# EAGLE schematic OSSI-1 Analog Temp Module (EAGLE 6.5.0)
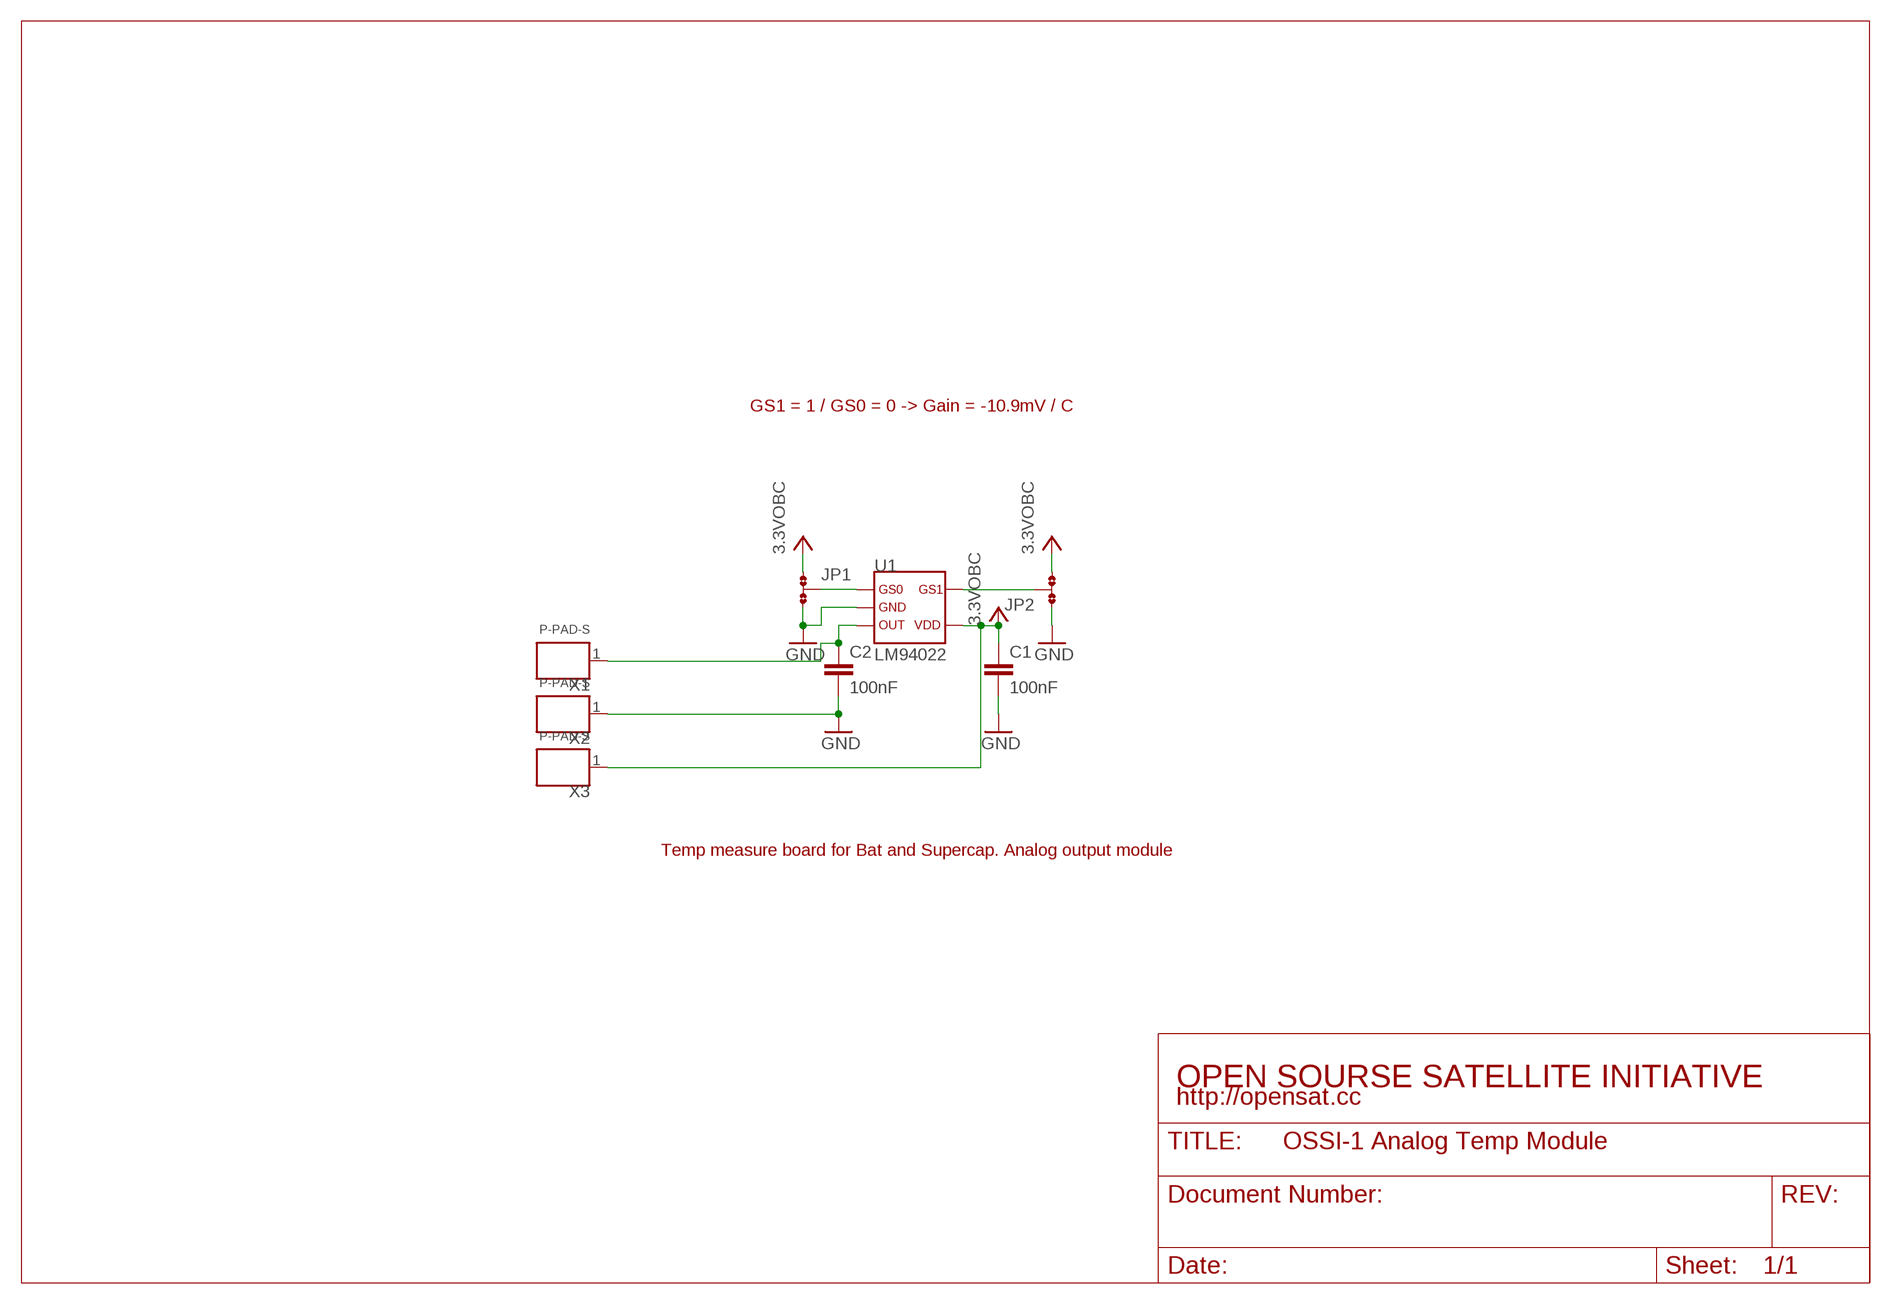
[diagram p0: schematic, sheet 1]

## Parts
C1  100nF  C0603(1608)  [C0603(1608)]
C2  100nF  C0603(1608)  [C0603(1608)]
JP1  JP2  [JP2SMD0603]
JP2  JP2  [JP2SMD0603]
U1  LM94022  [SC70-5]
X1  P-PAD-S  [P-PAD-S]
X2  P-PAD-S  [P-PAD-S]
X3  P-PAD-S  [P-PAD-S]

## Nets
3.3VOBC: C1.1 JP1.1 JP2.3 U1.P$4 X3.1
GND: C1.2 C2.2 JP1.3 JP2.1 U1.P$2 X2.1
N$1: JP1.2 U1.P$1
N$2: JP2.2 U1.P$5
N$3: C2.1 U1.P$3 X1.1

## Notes on the sheet
- GS1 = 1 / GS0 = 0 -> Gain = -10.9mV / C
- Temp measure board for Bat and Supercap. Analog output module
- OPEN SOURSE SATELLITE INITIATIVE
- http://opensat.cc

## Library data of the parts
C1 C2 = OSSI:C
JP1 JP2 = OSSI:JP2
U1 = OSSI:LM94022: LM94022 Temp Sensor From TI
X1-X3 = OSSI:P-PAD